# EAGLE design Trail-Traffic-Counter-Board (EAGLE 7.5.0)
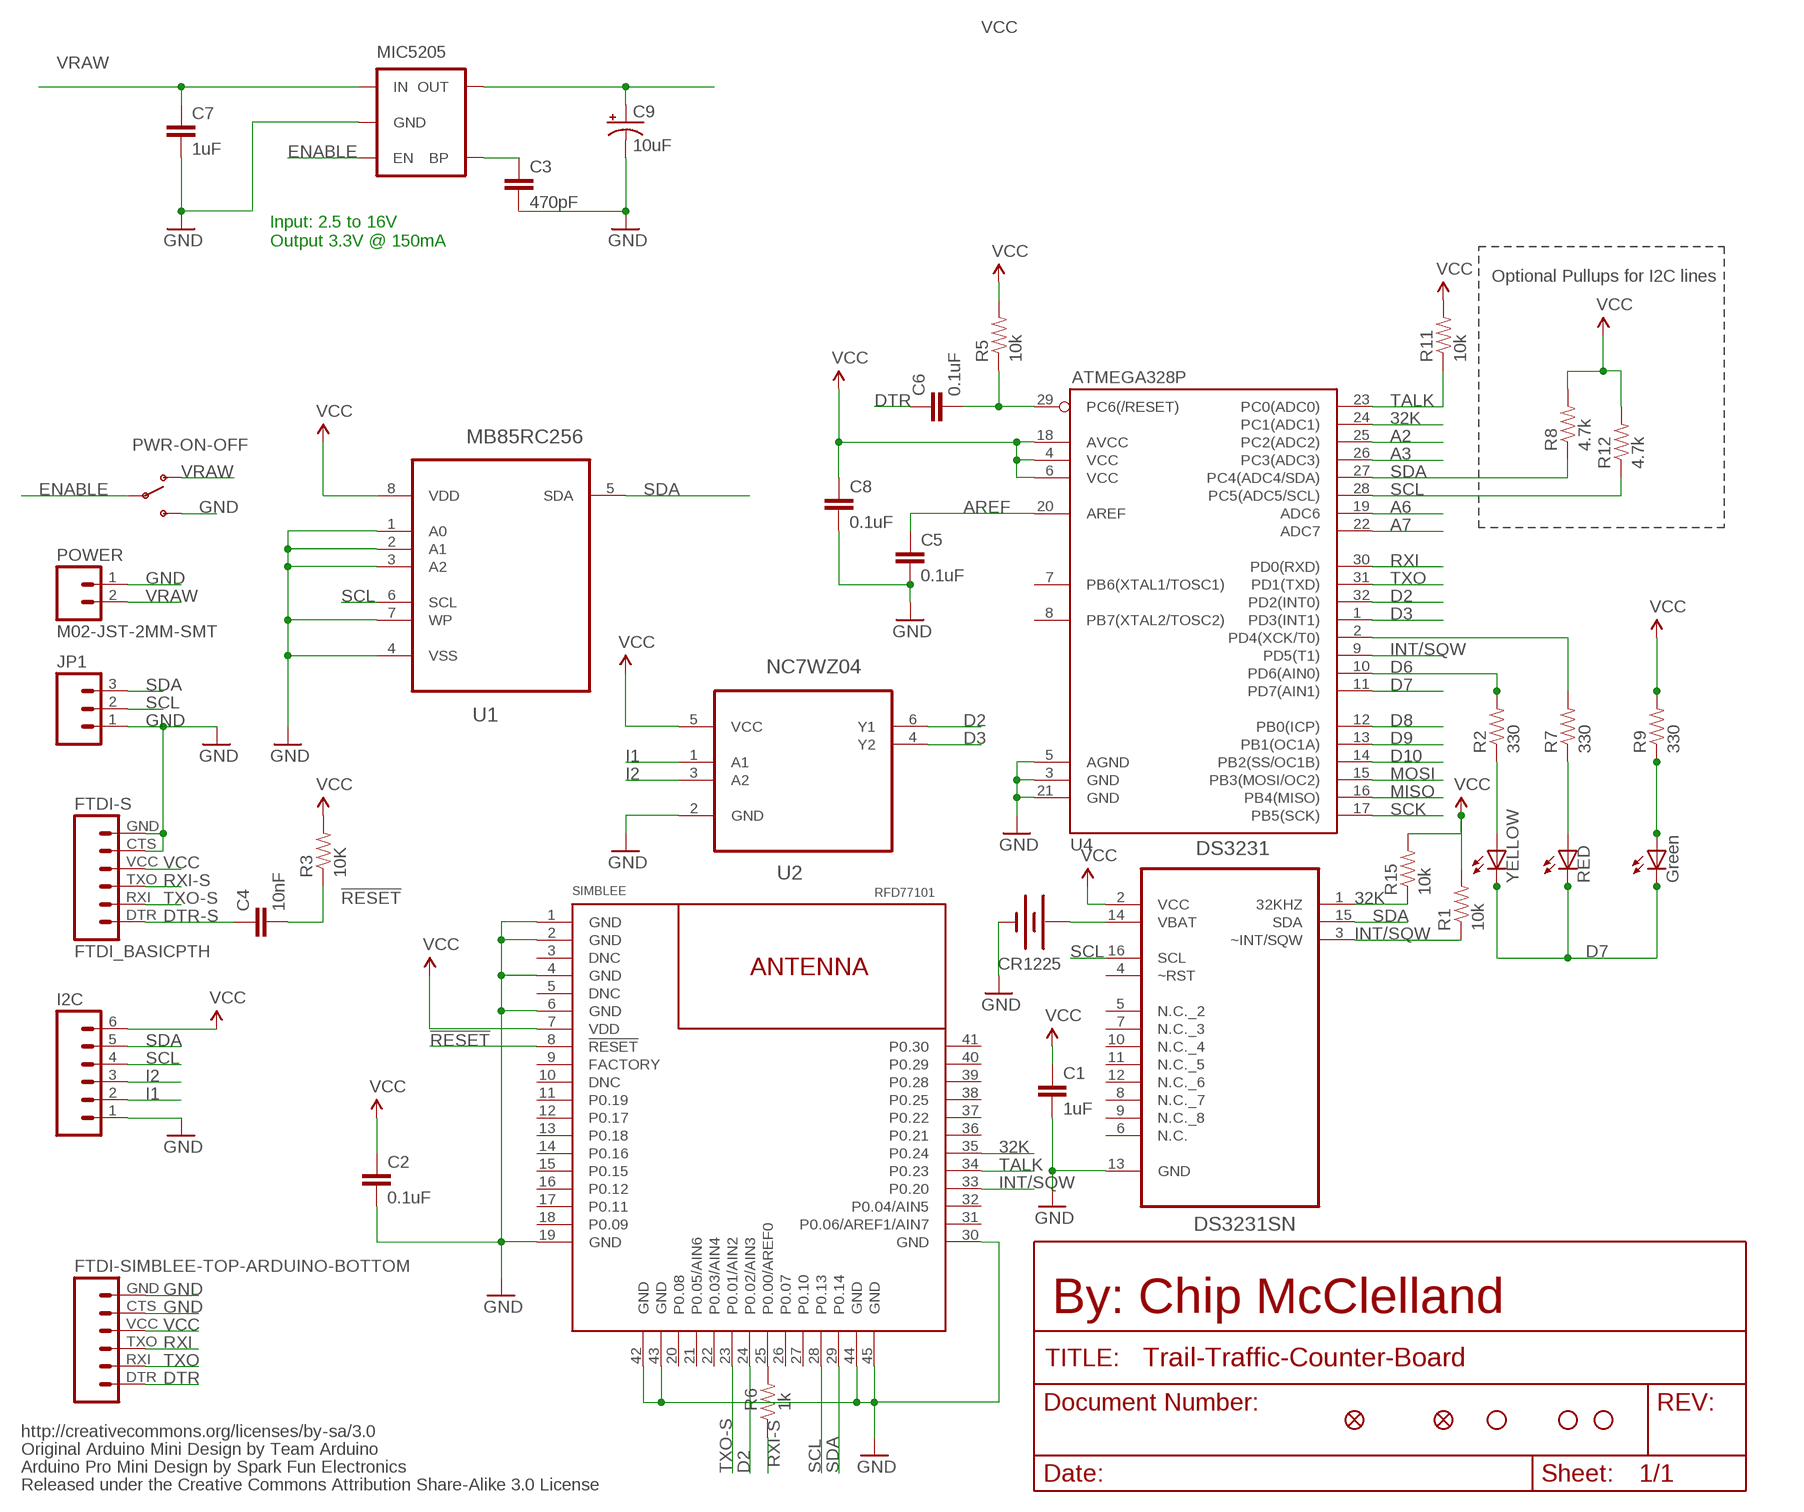
[diagram p0: schematic, sheet 1]

## Parts
ATMEGA328P  U4  ATMEGA168  [TQFP32-08]
C1  1uF  CAP0805  [0805]
C2  0.1uF  CAP0805  [0805]
C3  470pF  CAP0805  [0805]
C4  10nF  CAP0805  [0805]
C5  0.1uF  CAP0805  [0805]
C6  0.1uF  CAP0805  [0805]
C7  1uF  CAP0805  [0805]
C8  0.1uF  CAP0805  [0805]
C9  10uF  CAP_POL1206  [EIA3216]
CR1225  BATTERY12MM  [BATTCON_12MM]
DS3231  DS3231SN  [SOIC127P1032X265-16N]
FID1  FIDUCIALUFIDUCIAL  [MICRO-FIDUCIAL]
FID2  FIDUCIALUFIDUCIAL  [MICRO-FIDUCIAL]
FTDI-S  FTDI_BASICPTH  [FTDI_BASIC]
FTDI-SIMBLEE-TOP-ARDUINO-BOTTOM  FTDI Basic  FTDI_BASICPTH  [FTDI_BASIC]
G  Green  LEDCHIPLED_0805  [CHIPLED_0805]
I2C  M06LOCK  [1X06_LOCK]
JP1  M03LOCK  [1X03_LOCK]
JP3  STAND-OFF  [STAND-OFF]
JP4  STAND-OFF  [STAND-OFF]
JP6  STAND-OFF  [STAND-OFF]
MB85RC256  U1  MB85RC128PNF-G-JNE1  [SOIC127P600X175-8N]
MIC5205  MIC52053.3V  [SOT23-5]
NC7WZ04  U2  NC7WZ04P6X  [SOT65P210X110-6N]
POWER  M02-JST-2MM-SMT  [JST-2-SMD]
PWR-ON-OFF  SWITCH-SPDTPTH  [SWITCH-SPDT]
R  RED  LEDCHIPLED_0805  [CHIPLED_0805]
R1  10k  RESISTOR0805-RES  [0805]
R2  330  RESISTOR0603  [0603-RES]
R3  10K  RESISTOR0805-RES  [0805]
R5  10k  RESISTOR0805-RES  [0805]
R6  1k  RESISTOR0805-RES  [0805]
R7  330  RESISTOR0603  [0603-RES]
R8  4.7k  RESISTOR0805-RES  [0805]
R9  330  RESISTOR0603  [0603-RES]
R11  10k  RESISTOR0805-RES  [0805]
R12  4.7k  RESISTOR0805-RES  [0805]
R15  10k  RESISTOR0805-RES  [0805]
SIMBLEE  RFD77101  [RFD77101]
Y  YELLOW  LEDCHIPLED_0805  [CHIPLED_0805]

## Nets
32K: ATMEGA328P.24(PC1(ADC1)) DS3231.1(32KHZ) R15.1 SIMBLEE.35(P0.24)
!RESET: C4.2 R3.1 SIMBLEE.8(!RESET!)
A2: ATMEGA328P.25(PC2(ADC2))
A3: ATMEGA328P.26(PC3(ADC3))
A6: ATMEGA328P.19(ADC6)
A7: ATMEGA328P.22(ADC7)
AREF: ATMEGA328P.20(AREF) C5.1
D2: ATMEGA328P.32(PD2(INT0)) NC7WZ04.6(Y1) SIMBLEE.24(P0.02/AIN3)
D3: ATMEGA328P.1(PD3(INT1)) NC7WZ04.4(Y2)
D6: ATMEGA328P.10(PD6(AIN0)) R2.2
D7: ATMEGA328P.11(PD7(AIN1)) G.C R.C Y.C
D8: ATMEGA328P.12(PB0(ICP))
D9: ATMEGA328P.13(PB1(OC1A))
D10: ATMEGA328P.14(PB2(SS/OC1B))
DTR: C6.1 FTDI-SIMBLEE-TOP-ARDUINO-BOTTOM.DTR
DTR-S: C4.1 FTDI-S.DTR
ENABLE: MIC5205.3(EN) PWR-ON-OFF.2(P)
GND: ATMEGA328P.3(GND) ATMEGA328P.5(AGND) ATMEGA328P.21(GND) C1.2 C2.2 C3.2 C5.2 C7.2 C8.2 C9.C(-) CR1225.GND(-) DS3231.13(GND) FTDI-S.CTS FTDI-S.GND FTDI-SIMBLEE-TOP-ARDUINO-BOTTOM.CTS FTDI-SIMBLEE-TOP-ARDUINO-BOTTOM.GND I2C.1 JP1.1 MB85RC256.1(A0) MB85RC256.2(A1) MB85RC256.3(A2) MB85RC256.4(VSS) MB85RC256.7(WP) MIC5205.2(GND) NC7WZ04.2(GND) POWER.1 PWR-ON-OFF.3(S) SIMBLEE.1(GND) SIMBLEE.2(GND) SIMBLEE.4(GND) SIMBLEE.6(GND) SIMBLEE.19(GND) SIMBLEE.30(GND) SIMBLEE.42(GND) SIMBLEE.43(GND) SIMBLEE.44(GND) SIMBLEE.45(GND)
I1: I2C.2 NC7WZ04.1(A1)
I2: I2C.3 NC7WZ04.3(A2)
INT/SQW: ATMEGA328P.9(PD5(T1)) DS3231.3(~INT/SQW) R1.1 SIMBLEE.33(P0.20)
MISO: ATMEGA328P.16(PB4(MISO))
MOSI: ATMEGA328P.15(PB3(MOSI/OC2))
N$1: R2.1 Y.A
N$2: C3.1 MIC5205.4(BP)
N$3: ATMEGA328P.2(PD4(XCK/T0)) R7.2
N$4: R7.1 R.A
N$17: R6.2 SIMBLEE.25(P0.00/AREF0)
N$38: G.A R9.1
RESET: ATMEGA328P.29(PC6(/RESET)) C6.2 R5.1
RXI: ATMEGA328P.30(PD0(RXD)) FTDI-SIMBLEE-TOP-ARDUINO-BOTTOM.TXO
RXI-S: FTDI-S.TXO R6.1
SCK: ATMEGA328P.17(PB5(SCK))
SCL: ATMEGA328P.28(PC5(ADC5/SCL)) DS3231.16(SCL) I2C.4 JP1.2 MB85RC256.6(SCL) R12.1 SIMBLEE.28(P0.13)
SDA: ATMEGA328P.27(PC4(ADC4/SDA)) DS3231.15(SDA) I2C.5 JP1.3 MB85RC256.5(SDA) R8.1 SIMBLEE.29(P0.14)
TALK: ATMEGA328P.23(PC0(ADC0)) R11.1 SIMBLEE.34(P0.23)
TXO: ATMEGA328P.31(PD1(TXD)) FTDI-SIMBLEE-TOP-ARDUINO-BOTTOM.RXI
TXO-S: FTDI-S.RXI SIMBLEE.23(P0.01/AIN2)
VBAT: CR1225.PWR@1(+) DS3231.14(VBAT)
VCC: ATMEGA328P.4(VCC) ATMEGA328P.6(VCC) ATMEGA328P.18(AVCC) C1.1 C2.1 C8.1 C9.A(+) DS3231.2(VCC) FTDI-S.VCC FTDI-SIMBLEE-TOP-ARDUINO-BOTTOM.VCC I2C.6 MB85RC256.8(VDD) MIC5205.5(OUT) NC7WZ04.5(VCC) R1.2 R3.2 R5.2 R8.2 R9.2 R11.2 R12.2 R15.2 SIMBLEE.7(VDD)
VRAW: C7.1 MIC5205.1(IN) POWER.2 PWR-ON-OFF.1(O)
Unconnected: ATMEGA328P.7(PB6(XTAL1/TOSC1)) ATMEGA328P.8(PB7(XTAL2/TOSC2)) DS3231.4(~RST) DS3231.5(N.C._2) DS3231.6(N.C.) DS3231.7(N.C._3) DS3231.8(N.C._7) DS3231.9(N.C._8) DS3231.10(N.C._4) DS3231.11(N.C._5) DS3231.12(N.C._6) SIMBLEE.3(DNC) SIMBLEE.5(DNC) SIMBLEE.9(FACTORY) SIMBLEE.10(DNC) SIMBLEE.11(P0.19) SIMBLEE.12(P0.17) SIMBLEE.13(P0.18) SIMBLEE.14(P0.16) SIMBLEE.15(P0.15) SIMBLEE.16(P0.12) SIMBLEE.17(P0.11) SIMBLEE.18(P0.09) SIMBLEE.20(P0.08) SIMBLEE.21(P0.05/AIN6) SIMBLEE.22(P0.03/AIN4) SIMBLEE.26(P0.07) SIMBLEE.27(P0.10) SIMBLEE.31(P0.06/AREF1/AIN7) SIMBLEE.32(P0.04/AIN5) SIMBLEE.36(P0.21) SIMBLEE.37(P0.22) SIMBLEE.38(P0.25) SIMBLEE.39(P0.28) SIMBLEE.40(P0.29) SIMBLEE.41(P0.30)

## Notes on the sheet
- Input: 2.5 to 16V
  Output 3.3V @ 150mA
- Optional Pullups for I2C lines
- By: Chip McClelland
- http://creativecommons.org/licenses/by-sa/3.0
- Original Arduino Mini Design by Team Arduino
- Arduino Pro Mini Design by Spark Fun Electronics
- Released under the Creative Commons Attribution Share-Alike 3.0 License

## Library data of the parts
ATMEGA328P = SparkFun:ATMEGA168
C1 C2 C5 C6 C8 = SparkFun-Capacitors:CAP: Capacitor Standard 0603 ceramic capacitor, and 0.1" leaded capacitor.
C3 C4 C7 = SparkFun-Passives:CAP: Capacitor Standard 0603 ceramic capacitor, and 0.1" leaded capacitor.
C9 = SparkFun-Capacitors:CAP_POL: Capacitor Polarized These are standard SMD and PTH capacitors. Normally 10uF, 47uF, and 100uF in electrolytic and tantalum varieties. Always verify the external diameter of the through hole cap, it varies with capacity, voltage, and manufacturer. The EIA devices should be standard.
CR1225 = SparkFun-Electromechanical:BATTERY: Battery Holders Various common sizes : AA, AAA, 20mm coin cell and 12mm coin cell. 20MM_4LEGS, BATT-10373
DS3231 = Maxim_By_element14_Batch_1:DS3231SN: Extremely Accurate I2C-Integrated RTC/TCXO/Crystal; MPN: DS3231SN#; OC_FARNELL: 1593292; OC_NEWARK: 68K3406; PACKAGE: SOIC-16; SUPPLIER: Maxim
FID1 FID2 = SparkFun-Aesthetics:FIDUCIAL: Fiducial Alignment Points Various fiducial points for machine vision alignment.
FTDI-S FTDI-SIMBLEE-TOP-ARDUINO-BOTTOM = SparkFun-Connectors:FTDI_BASIC: FTDI Basic header with labels
G R Y = adafruit:LED: LED OSRAM: - CHIPLED LG R971, LG N971, LY N971, LG Q971, LY Q971, LO R971, LY R971 LH N974, LH R974 LS Q976, LO Q976, LY Q976 LO Q996 - Hyper CHIPLED LW Q18S LB Q993, LB Q99A, LB R99A - SideLED LS A670, LO A670, LY A670, LG A670, LP A670 LB A673, LV A673, LT A673, LW A673 LH A674 LY A675 LS A676, LA A676, LO A676, LY A676, LW A676 LS A679, LY A679, LG A679 - Hyper Micro SIDELED® LS Y876, LA Y876, LO Y876, LY Y876 LT Y87S - SmartLED LW L88C, LW L88S LB L89C, LB L89S, LG L890 LS L89K, LO L89K, LY L89K LS L896, LA L896, LO L896, LY L896 - TOPLED LS T670, LO T670, LY T670, LG T670, LP T670 LSG T670, LSP T670, LSY T670, LOP T670, LYG T670 LG T671, LOG T671, LSG T671 LB T673, LV T673, LT T673, LW T673 LH T674 LS T676, LA T676, LO T676, LY T676, LB T676, LH T676, LSB T676, LW T676 LB T67C, LV T67C, LT T67C, LS T67K, LO T67K, LY T67K, LW E67C LS E67B, LA E67B, LO E67B, LY E67B, LB E67C, LV E67C, LT E67C LW T67C LS T679, LY T679, LG T679 LS T770, LO T770, LY T770, LG T770, LP T770 LB T773, LV T773, LT T773, LW T773 LH T774 LS E675, LA E675, LY E675, LS T675 LS T776, LA T776, LO T776, LY T776, LB T776 LHGB T686 LT T68C, LB T68C - Hyper Mini TOPLED® LB M676 - Mini TOPLED Santana® LG M470 LS M47K, LO M47K, LY M47K Source: http://www.osram.convergy.de/
I2C = SparkFun-Connectors:M06: Header 6 Standard 6-pin 0.1" header. Use with straight break away headers (SKU : PRT-00116), right angle break away headers (PRT-00553), swiss pins (PRT-00743), machine pins (PRT-00117), and female headers (PRT-00115). Molex polarized connector foot print use with SKU : PRT-08094 with associated crimp pins and housings. NOTES ON THE VARIANTS LOCK and LOCK_LONGPADS... This footprint was designed to help hold the alignment of a through-hole component (i.e. 6-pin header) while soldering it into place. You may notice that each hole has been shifted either up or down by 0.005 of an inch from it's more standard position (which is a perfectly straight line). This slight alteration caused the pins (the squares in the middle) to touch the edges of the holes. Because they are alternating, it causes a "brace" to hold the component in place. 0.005 has proven to be the perfect amount of "off-center" position when using our standard breakaway headers. Although looks a little odd when you look at the bare footprint, once you have a header in there, the alteration is very hard to notice. Also,if you push a header all the way into place, it is covered up entirely on the bottom side. This idea of altering the position of holes to aid alignment will be further integrated into the Sparkfun Library for other footprints. It can help hold any component with 3 or more connection pins.
JP1 = SparkFun-Connectors:M03: Header 3 Standard 3-pin 0.1" header. Use with straight break away headers (SKU : PRT-00116), right angle break away headers (PRT-00553), swiss pins (PRT-00743), machine pins (PRT-00117), and female headers (PRT-00115). Molex polarized connector foot print use with SKU : PRT-08232 with associated crimp pins and housings.
JP3 JP4 JP6 = SparkFun:STAND-OFF: Stand Off This is the mechanical footprint for a #4 phillips button head screw. Use the keepout ring to avoid running the screw head into surrounding components. SKU : PRT-00447
MB85RC256 = Fujitsu_By_element14_Batch_1:MB85RC128PNF-G-JNE1: Memory FRAM; MPN: MB85RC128PNF-G-JNE1; OC_FARNELL: 1831995; OC_NEWARK: 93R5161; PACKAGE: SO-8; SUPPLIER: FUJITSU
MIC5205 = SparkFun-PowerIC:MIC5205: MIC5205 150mA vreg 3.3V - VREG-00822 5V - VREG-00823; PROD_ID: VREG-00822
NC7WZ04 = Fairchild_By_element14_Batch_1:NC7WZ04P6X: UHS Dual Inverter; MPN: NC7WZ04P6X; OC_FARNELL: 1417665; OC_NEWARK: 58K1999; PACKAGE: SC-70-6; SUPPLIER: FAIRCHILD SEMICONDUCTOR
POWER = SparkFun-Connectors:M02: Standard 2-pin 0.1" header. Use with - straight break away headers ( PRT-00116) - right angle break away headers (PRT-00553) - swiss pins (PRT-00743) - machine pins (PRT-00117) - female headers (PRT-00115) Molex polarized connector foot print use with: PRT-08233 with associated crimp pins and housings. 2.54_SCREWTERM for use with PRT-10571. 3.5mm Screw Terminal footprints for PRT-08084 5mm Screw Terminal footprints for use with PRT-08433; PROD_ID: CONN-08352
PWR-ON-OFF = SparkFun-Electromechanical:SWITCH-SPDT: SPDT Switch Simple slide switch, Spark Fun Electronics SKU : COM-00102 DPDT SMT slide switch, AYZ0202, SWCH-08179
R1 R3 R5 R6 R11 R15 = SparkFun-Passives:RESISTOR: Resistor Basic schematic elements and footprints for 0603, 1206, and PTH resistors.
R2 R7-R9 R12 = SparkFun-Resistors:RESISTOR: Resistor Basic schematic elements and footprints for 0603, 1206, and PTH resistors.
SIMBLEE = RFDigital:RFD77101: Simblee ™ BLE Module RFD77101 © 2015 RF Digital Corporation www.RFDigital.com www.Simblee.com PATENTS PENDING 04.01.2015

## Net classes
0 default: width 0.203 mm, drill 0.33 mm
1 vcc: width 0.254 mm

## Board
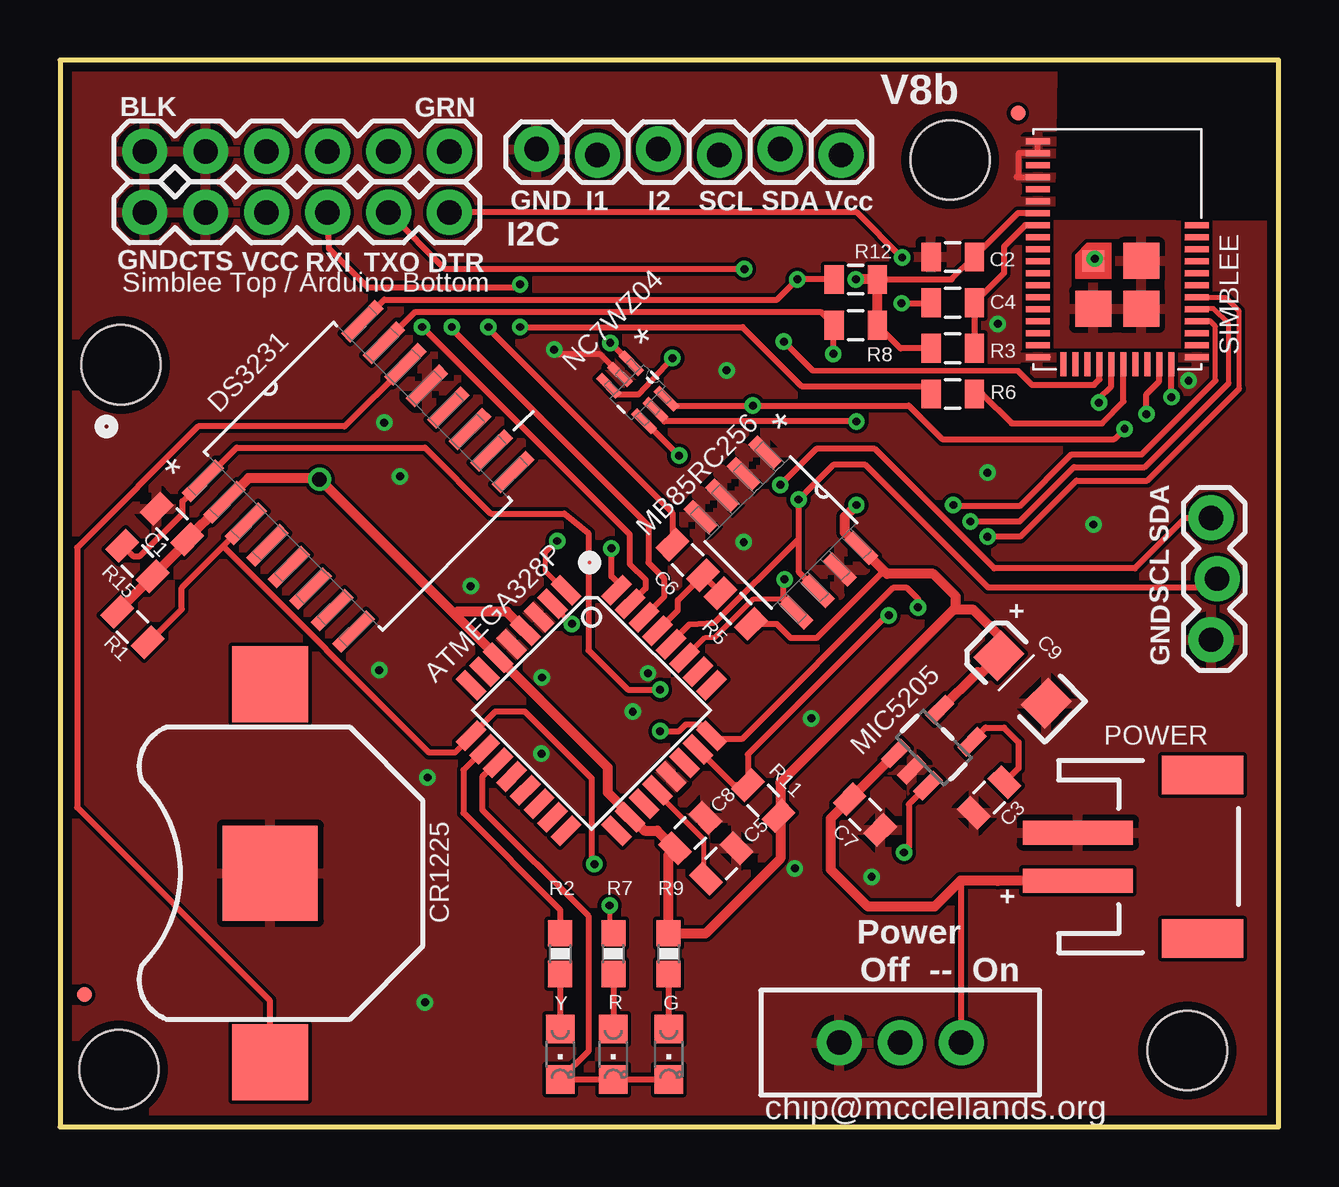
[diagram p1: board, top side]
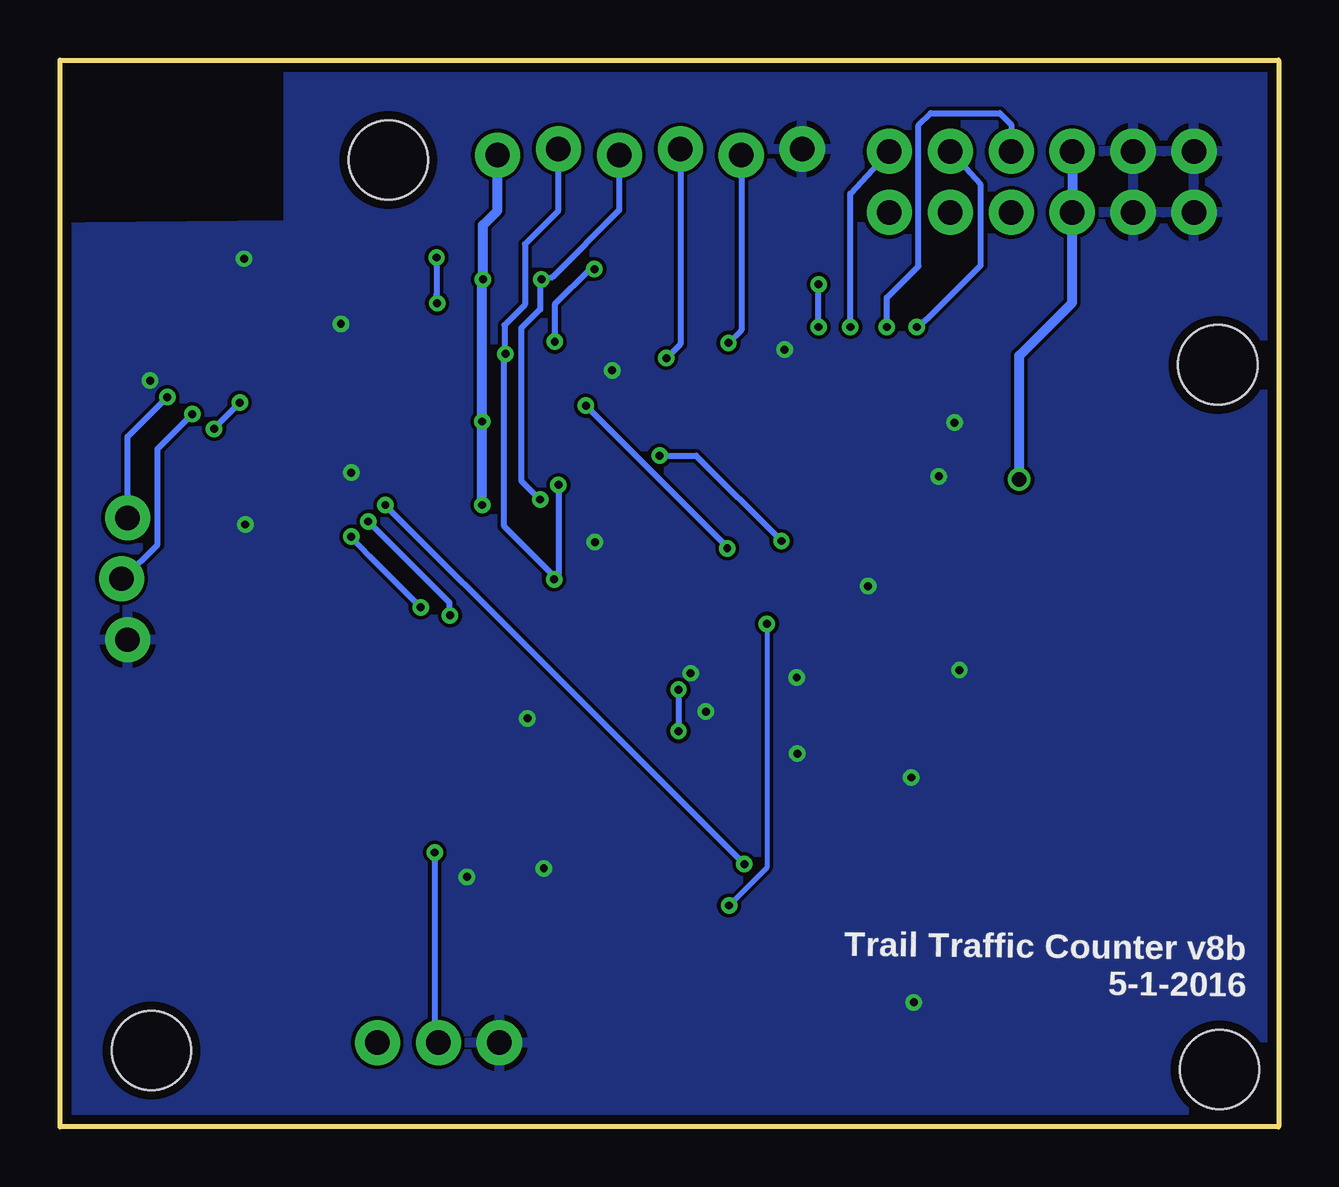
[diagram p2: board, bottom side, seen from below]

Size 50.8 x 44.45 mm. Coordinates in mm from the lower left corner, seen from the top.
Outline: 0,44.45 0,0 50.8,0 50.8,44.45 0,44.45
Copper layers (1*16): Top 0.0356mm / dielectric 1.5011mm / Bottom 0.0356mm
Design rules "LaenPCBOrder": minimum track width 6mil, minimum drill 13mil, track to track 6mil, track to pad 6mil, pad to pad 6mil, via to via 6mil, smd to smd 6mil, copper to edge 15mil, drill to drill 6mil, minimum pad ring 7mil, minimum via ring 7mil, stop-mask expansion 3mil, vias tented up to drill 0mil, thermal gap 10mil

### Footprints (pad centres in the part's own frame; a part is rotated, then mirrored left to right if it is on the bottom)
TQFP32-08 = smd 1.27 x 0.559: 1 -4.293,2.8; 2 -4.293,2; 3 -4.293,1.2; 4 -4.293,0.4; 5 -4.293,-0.4; 6 -4.293,-1.2; 7 -4.293,-2; 8 -4.293,-2.8; 17 4.293,-2.8; 18 4.293,-2; 19 4.293,-1.2; 20 4.293,-0.4; 21 4.293,0.4; 22 4.293,1.2; 23 4.293,2; 24 4.293,2.8 | smd 0.559 x 1.27: 9 -2.8,-4.293; 10 -2,-4.293; 11 -1.2,-4.293; 12 -0.4,-4.293; 13 0.4,-4.293; 14 1.2,-4.293; 15 2,-4.293; 16 2.8,-4.293; 25 2.8,4.293; 26 2,4.293; 27 1.2,4.293; 28 0.4,4.293; 29 -0.4,4.293; 30 -1.2,4.293; 31 -2,4.293; 32 -2.8,4.293
0805 = smd 0.8 x 1.2: 1 -0.9,0; 2 0.9,0
EIA3216 = smd 1.4 x 1.6: A 1.4,0; C -1.4,0
BATTCON_12MM = smd 3.962 x 3.962: GND 0,0 | smd 3.175 x 3.175: PWR@1 -7.874,0; PWR@2 7.874,0
SOIC127P1032X265-16N = smd 1.981 x 0.533: 1 -4.699,4.445; 2 -4.699,3.175; 3 -4.699,1.905; 4 -4.699,0.635; 5 -4.699,-0.635; 6 -4.699,-1.905; 7 -4.699,-3.175; 8 -4.699,-4.445; 9 4.699,-4.445; 10 4.699,-3.175; 11 4.699,-1.905; 12 4.699,-0.635; 13 4.699,0.635; 14 4.699,1.905; 15 4.699,3.175; 16 4.699,4.445
MICRO-FIDUCIAL = smd 0.635 x 0.635: 1 0,0
FTDI_BASIC = drill 1.016 pad 1.88: CTS 10.16,0; DTR 0,0; GND 12.7,0; RXI 2.54,0; TXO 5.08,0; VCC 7.62,0
CHIPLED_0805 = smd 1.2 x 1.2: A 0,-1.05; C 0,1.05
1X06_LOCK = drill 1.016 pad 1.88: 1 0,0; 2 2.54,-0.254; 3 5.08,0; 4 7.62,-0.254; 5 10.16,0; 6 12.7,-0.254
1X03_LOCK = drill 1.016 pad 1.88: 1 0,0.127; 2 2.54,-0.127; 3 5.08,0.127
STAND-OFF = hole 3.302: 0,0
SOIC127P600X175-8N = smd 1.473 x 0.559: 1 -2.819,1.905; 2 -2.819,0.635; 3 -2.819,-0.635; 4 -2.819,-1.905; 5 2.819,-1.905; 6 2.819,-0.635; 7 2.819,0.635; 8 2.819,1.905
SOT23-5 = smd 0.55 x 1.2: 1 -0.95,-1.3; 2 0,-1.3; 3 0.95,-1.3; 4 0.95,1.3; 5 -0.95,1.3
SOT65P210X110-6N = smd 1.168 x 0.356: 1 -1.041,0.66; 2 -1.041,0; 3 -1.041,-0.66; 4 1.041,-0.66; 5 1.041,0; 6 1.041,0.66
JST-2-SMD = smd 1 x 4.6: 1 -1,-3.7; 2 1,-3.7 | smd 1.6 x 3.4: NC1 -3.4,1.5; NC2 3.4,1.5
SWITCH-SPDT = drill 1.016 pad 1.88: 1 0,2.54; 2 0,0; 3 0,-2.54
0603-RES = smd 1.1 x 1: 1 -0.85,0; 2 0.85,0
RFD77101 = smd 1 x 0.254: 1 0,0; 2 0,-0.5; 3 0,-1; 4 0,-1.5; 5 0,-2; 6 0,-2.5; 7 0,-3; 8 0,-3.5; 9 0,-4; 10 0,-4.5; 11 0,-5; 12 0,-5.5; 13 0,-6; 14 0,-6.5; 15 0,-7; 16 0,-7.5; 17 0,-8; 18 0,-8.5; 19 0,-9; 30 6.61,-9; 31 6.61,-8.5; 32 6.61,-8; 33 6.61,-7.5; 34 6.61,-7; 35 6.61,-6.5; 36 6.61,-6; 37 6.61,-5.5; 38 6.61,-5; 39 6.61,-4.5; 40 6.61,-4; 41 6.61,-3.5 | smd 0.254 x 1: 20 1.055,-9.29; 21 1.555,-9.29; 22 2.055,-9.29; 23 2.555,-9.29; 24 3.055,-9.29; 25 3.555,-9.29; 26 4.055,-9.29; 27 4.555,-9.29; 28 5.055,-9.29; 29 5.555,-9.29 | smd 0.9 x 0.9: 42 2.3,-4.99 | smd 1.5 x 1.5: 43 2.3,-6.99; 44 4.3,-6.99; 45 4.3,-4.99

### Placement (x,y rotation side)
ATMEGA328P  22.15,17.35 315 top
C1  4.67,25.12 135 top
C2  37.21,36.25 180 top
C3  38.73,13.72 225 top
C4  37.21,34.34 0 top
C5  27.56,10.97 45 top
C6  26.16,23.62 315 top
C7  33.55,13 315 top
C8  26.26,12.24 45 top
C9  40.13,18.64 135 top
CR1225  8.76,10.57 90 top
DS3231  12.42,27.1 45 top
FID1  1.02,5.51 0 top
FID2  39.93,42.24 0 top
FTDI-S  16.23,38.1 180 top
FTDI-SIMBLEE-TOP-ARDUINO-BOTTOM  16.23,40.64 180 top
G  25.37,3.02 180 top
I2C  19.86,40.74 0 top
JP1  48.11,20.29 90 top
JP2  STAND-OFF  [STAND-OFF]  2.54,31.75 0 top
JP3  2.46,2.39 0 top
JP4  46.99,3.17 0 top
JP6  37.11,40.28 0 top
MB85RC256  30.05,24.77 315 top
MIC5205  36.42,15.8 315 top
NC7WZ04  24.08,30.61 315 top
POWER  46.13,11.25 270 top
PWR-ON-OFF  35.03,3.51 270 top
R  23.06,3.02 180 top
R1  3.02,20.83 135 top
R2  20.85,7.21 90 top
R3  37.21,32.44 180 top
R5  28.17,21.59 315 top
R6  37.21,30.53 0 top
R7  23.06,7.21 90 top
R8  33.17,33.4 0 top
R9  25.37,7.21 90 top
R11  29.31,13.59 315 top
R12  33.17,35.31 0 top
R15  3.23,23.57 315 top
SIMBLEE  40.77,41.07 0 top
Y  20.85,3.02 180 top

### Tracks (layer width: path | path; a pad name or v marks a point on that pad's centre or on a via)
32K  (via drill 0.33)
  Top 0.203: 47.35,34.57 SIMBLEE.35 47.41,34.54 48.59,34.54 49.15,33.98 49.15,30.76
  Top 0.254: v38.66,24.59 40.03,24.59 42.37,26.92 45.31,26.92 49.15,30.76 | v35.76,21.64 35.76,22 35.31,22.45 34.72,22.45 28.42,16.15 27.3,16.15 ATMEGA328P.24 26.69,16.76 26.09,16.76 25.81,16.48 v25.02,16.48 | R15.1 2.62,24.21 3.05,23.77 3.33,23.77 5.11,25.55 5.11,26.07 DS3231.1 5.99,26.92 7.37,28.3 15.21,28.3 17.96,25.55 21.03,25.55 22.02,24.74 22.02,19.84 22.05,19.84 23.67,18.21 v25.02,18.21
  Bottom 0.254: v38.66,24.59 37.9,23.77 v35.76,21.64 | v25.02,18.21 v25.02,16.48
!RESET
  Top 0.254: SIMBLEE.8 40.24,37.57 39.34,36.68 39.34,35.57 C4.2 R3.1
AREF
  Top 0.203: C5.1 26.82,10.39 26.82,11.99 24.87,13.95 ATMEGA328P.20
D2  (via drill 0.33)
  Top 0.254: v44.37,29.08 43.94,28.65 36.78,28.65 35.38,30.05 v28.88,30.05 25.57,30.05 NC7WZ04.6 | v43.31,30.18 43.31,30.33 43.81,30.84 SIMBLEE.24 | ATMEGA328P.32 23.2,22.39 23.5,22.68 23.24,22.68 22.99,22.94 v22.99,24.11
  Bottom 0.254: v44.37,29.08 44.37,29.11 v43.31,30.18 | v22.99,24.11 22.99,24.16 v28.88,30.05
D3  (via drill 0.33)
  Top 0.203: ATMEGA328P.1 21.02,22.36 20.24,23.14 20.24,23.93 v20.73,24.41
  Top 0.254: NC7WZ04.4 24.37,29.4 v25.81,27.96
  Bottom 0.254: v25.81,27.96 24.28,27.96 v20.73,24.41
D6
  Top 0.203: 20.7,8.1 R2.2
  Top 0.254: ATMEGA328P.10 17.68,15.73 16.82,14.86 16.82,13.08 20.85,9.04 R2.2
D7
  Top 0.203: 25.5,1.88 G.C
  Top 0.254: G.C R.C Y.C 22.02,3.14 22.02,8.79 17.6,13.21 17.6,14.58 18.18,15.16 ATMEGA328P.11
DTR  (via drill 0.33)
  Top 0.254: v17.86,33.33 17.86,33.25 25.53,25.58 C6.1
  Bottom 0.254: v17.86,33.33 17.86,38.89 FTDI-SIMBLEE-TOP-ARDUINO-BOTTOM.DTR
DTR-S  (via drill 0.33)
  Top 0.254: v35.08,34.31 36.29,34.31 C4.1 | FTDI-S.DTR 33.22,38.1 v35.1,36.22
  Bottom 0.254: v35.1,36.22 35.1,34.67 v35.08,34.31
ENABLE  (via drill 0.33)
  Top 0.254: MIC5205.3 36.15,14.21 35.38,13.44 35.38,11.63 v35.18,11.43
  Bottom 0.254: v35.18,11.43 35.18,3.66 PWR-ON-OFF.2
GND  (via drill 0.33)
  Top 0.254: SIMBLEE.1 SIMBLEE.2 39.99,40.57 39.95,40.54 39.95,39.65 39.88,39.57 SIMBLEE.4 | SIMBLEE.44 | SIMBLEE.19 41.19,32.07 | 43.05,34.07 SIMBLEE.43 | NC7WZ04.2 22.5,32.18 20.8,32.18 v20.6,32.38
  other vias: 13.31,19.02 17.12,22.53 14.17,27.1 30.63,10.77 20.09,18.72 20.07,15.54 23.88,17.3 24.51,18.9 31.32,17.02 33.83,10.41 47.04,31.09 28.5,24.36 39.09,33.45 43.13,36.17 15.32,14.55 43.08,25.1 38.66,27.25 27.79,31.52 13.51,29.34 15.21,5.18
  pour Bottom: 3.66,45.34 -1.4,45.44 -1.22,-4.7 51.54,-4.85 51.54,35.59 51.82,35.66 51.84,37.49 41.27,37.59 41.27,45.06
  pour Top: -1.35,45.47 -1.55,-4.65 51.54,-4.72 51.77,37.54 41.27,37.59 41.4,45.19
I1  (via drill 0.33)
  Top 0.254: v22.94,32.66 22.96,32.66 NC7WZ04.1
  Bottom 0.254: I2C.2 22.4,33.2 v22.94,32.66
I2  (via drill 0.33)
  Top 0.254: v25.53,32.03 24.11,30.5 23.14,30.5 NC7WZ04.3
  Bottom 0.254: I2C.3 24.94,32.61 v25.53,32.03
INT/SQW  (via drill 0.33, 0.33 pad 0.25)
  Top 0.203: 17.04,16.43 ATMEGA328P.9 | 48.16,31.09 48.16,33.35 47.93,33.58 SIMBLEE.33
  Top 0.254: ATMEGA328P.9 18.14,17.3 19.38,17.3 22.17,14.5 22.17,10.95 v22.28,10.95 | 48.16,31.09 45.09,28.02 42.16,28.02 40.01,25.86 37.29,25.86 v37.24,25.91 | R1.1 3.71,20.19 5.08,21.57 5.08,22.45 6.81,24.18 | 6.81,24.18 DS3231.3 | 17.04,16.43 17.04,16.18 16.46,15.6 15.39,15.6 6.81,24.18
  Bottom 0.254: v37.24,25.91 37.16,25.81 30.79,19.46 v22.28,10.95
N$1
  Top 0.254: R2.1 Y.A
N$2
  Top 0.254: MIC5205.4 38.02,16.07 38.58,16.64 39.34,16.64 39.95,16.03 39.95,14.94 C3.1
N$3  (via drill 0.33)
  Top 0.203: v22.91,9.22 22.91,8.15 R7.2 | v21.34,20.95 20.6,21.67 ATMEGA328P.2
  Bottom 0.203: 22.94,9.2 v22.91,9.22 21.34,10.79 v21.34,20.95
N$4
  Top 0.254: R7.1 R.A
N$17
  Top 0.254: R6.2 38.46,30.53 39.67,29.31 43.43,29.31 44.32,30.23 44.32,31.75 SIMBLEE.25
N$38
  Top 0.254: R9.1 G.A
RESET
  Top 0.254: ATMEGA328P.29 24.91,20.67 25.76,21.51 25.76,21.94 C6.2 27.48,22.3 | R5.1 27.53,22.25 27.48,22.3 | 27.48,22.3
RXI  (via drill 0.33)
  Top 0.203: ATMEGA328P.30 24.33,21.13
  Top 0.254: ATMEGA328P.30 25.2,22.1 25.2,22.84 24.51,23.52 24.54,23.55 24.54,25.04 16.33,33.25 v16.33,33.33
  Bottom 0.254: v16.33,33.33 16.33,34.54 15.01,35.87 15.01,41.73 14.5,42.24 11.63,42.24 11.15,41.76 FTDI-SIMBLEE-TOP-ARDUINO-BOTTOM.TXO
RXI-S  (via drill 0.33)
  Top 0.254: v19.18,33.33 28.45,33.33 30.91,30.86 35.98,30.86 R6.1 | v19.18,35.1 19.05,34.98 12.83,34.98 11.2,36.6 FTDI-S.TXO
  Bottom 0.254: v19.18,33.33 v19.18,35.1
SCL  (via drill 0.33)
  Top 0.254: R12.1 v30.73,35.31 29.9,34.47 13.51,34.47 12.61,33.57 DS3231.16 | ATMEGA328P.28 25.54,20.1 25.54,20.23 26.24,20.93 27.28,21.01 30.79,24.49 | 30.79,24.49 v30.79,26.14 32.23,27.58 33.58,27.58 38.68,22.48 47.88,22.48 JP1.2 | 30.79,24.49 30.79,23.13 MB85RC256.6 | v45.29,29.69 45.29,30.53 45.82,31.06 SIMBLEE.28
  Bottom 0.254: I2C.4 27.48,38.2 30.28,35.41 v30.73,35.31 30.79,35.26 30.79,34.06 31.57,33.27 31.57,26.92 v30.79,26.14 | JP1.2 48.16,22.84 46.74,24.26 46.74,28.25 v45.29,29.69
SDA  (via drill 0.33)
  Top 0.203: 30.15,21.97 28.88,21.97 27.28,20.37 26.87,20.37 ATMEGA328P.27
  Top 0.254: R8.1 32.23,33.17 | ATMEGA328P.27 | MB85RC256.5 30.15,21.97 30.15,22.76 v30.2,22.81 | DS3231.15 14.81,33.96 31.71,33.96 R8.1 | v46.33,30.4 SIMBLEE.29 | JP1.3 46.91,25.38 44.81,23.27 38.94,23.27 33.96,28.25 31.52,28.25 v30.02,26.75 | v32.23,32.21 32.23,33.36 R8.1
  Bottom 0.254: I2C.5 30.02,38.18 31.42,36.78 31.42,34.25 R8.1 32.27,32.25 v32.23,32.21 32.28,32.16 32.28,25.02 30.2,22.94 v30.2,22.81 30.02,22.99 v30.02,26.75 | JP1.3 47.98,28.75 v46.33,30.4
TALK  (via drill 0.33)
  Top 0.203: 47.36,34.09 SIMBLEE.34 47.39,34.09 48.08,34.09 48.72,33.45 48.72,30.99
  Top 0.254: v37.95,25.22 40.01,25.22 42.27,27.48 45.21,27.48 48.72,30.99 | v34.54,21.31 34.47,21.31 28.68,15.52 R11.1 28.1,14.22 ATMEGA328P.23
  Bottom 0.203: 38.02,25.22 v37.95,25.22
  Bottom 0.254: v34.54,21.31 34.57,21.31 34.57,21.84 v37.95,25.22
TXO  (via drill 0.33)
  Top 0.254: 23.77,21.81 ATMEGA328P.31 24.41,22.44 24.41,22.78 23.75,23.44 23.75,24.69 15.11,33.33 v15.09,33.33
  Bottom 0.254: v15.09,33.33 14.61,33.71 12.42,35.89 12.42,39.24 FTDI-SIMBLEE-TOP-ARDUINO-BOTTOM.RXI
TXO-S  (via drill 0.33)
  Top 0.254: v30.18,32.72 31.37,31.52 39.93,31.5 40.51,30.91 43.1,30.91 43.33,31.14 43.33,31.77 SIMBLEE.23 | v28.52,35.74 16.05,35.74 FTDI-S.RXI
  Bottom 0.254: v28.52,35.74 28.7,35.74 30.18,34.27 v30.18,32.72
VBAT
  Top 0.254: DS3231.14 14.4,31.72 11.86,29.18 5.77,29.18 0.71,24.13 0.71,13.31 8.74,5.28 8.74,2.72 CR1225.PWR@1
VCC  (via drill 0.33, 0.6)
  Top 0.203: 25.22,8.15 R9.2 25.58,8.15
  Top 0.254: R11.2 29.95,13.21 30.02,13.28 | v33.2,29.39 25.2,29.39 NC7WZ04.5 | SIMBLEE.7 39.94,38.07 C2.1 37.16,35.31 34.09,35.31 | R3.2 35.04,32.44 R8.2 | R5.2 29.87,20.95 30.45,20.37 31.55,20.37 34.34,23.17
  Top 0.406: v10.82,26.98 10.77,27.03 10.64,27.03 | v10.82,26.98 16.46,21.34 | 16.46,21.34 ATMEGA328P.6 22.84,14.96 22.84,13.92 23.77,12.98 ATMEGA328P.18 23.8,12.9 24.36,12.34 24.89,12.34 C8.1 | C8.1 25.63,11.43 | 25.39,8.08 R9.2 | 10.64,27.03 7.85,27.03 DS3231.2 | DS3231.2 6.85,25.91 | v10.82,26.98 10.69,26.98 10.64,27.03 | DS3231.2 5.16,24.35 C1.1 5.16,24.31 5.16,24.23 R15.2 R1.2 | ATMEGA328P.4 19.4,20.68 18.62,21.46 16.59,21.46 16.46,21.34 | R8.2 R12.2 | 34.09,35.31 R12.2 | 37.24,21.54 30.02,14.33 30.02,13.28 30.02,11.18 26.9,8.05 25.39,8.05 R9.2 | 37.24,21.54 37.34,21.64 37.34,22.1 36.4,23.04 34.47,23.04 34.34,23.17 MB85RC256.8 33.36,24.12 32.72,24.77 32.72,25.43 v33.2,25.91 | R12.2 v33.17,35.31 | MIC5205.5 36.69,17.39 38.25,18.95 38.46,18.95 C9.A 39.14,20.47 38.08,21.54 37.24,21.54 | R9.2 25.38,11.35 C8.1
  Bottom 0.406: v10.82,26.98 10.82,32.13 8.61,34.34 FTDI-S.VCC FTDI-SIMBLEE-TOP-ARDUINO-BOTTOM.VCC | I2C.6 32.56,38.18 33.17,37.57 v33.17,35.31 33.2,35.28 v33.2,29.39 v33.2,25.91
VRAW
  Top 0.254: PWR-ON-OFF.1 37.57,10.24 37.54,10.26
  Top 0.406: POWER.2 39.08,10.25 37.54,10.26 36.45,9.17 33.68,9.17 32.13,10.72 32.13,12.86 C7.1 MIC5205.1

### Text on the board
tPlace: GRN | BLK | GND | I1 | I2 | SCL | SDA | Vcc | GND | CTS | VCC | RXI | TXO | DTR | Simblee Top / Arduino Bottom | SDA | SCL | + | GND | + | Power | Off -- On
tNames: V8b | chip@mcclellands.org
bNames: Trail Traffic Counter v8b / 5-1-2016
Name: V5a